# EAGLE design boardv1.1 (EAGLE 8.3.2)
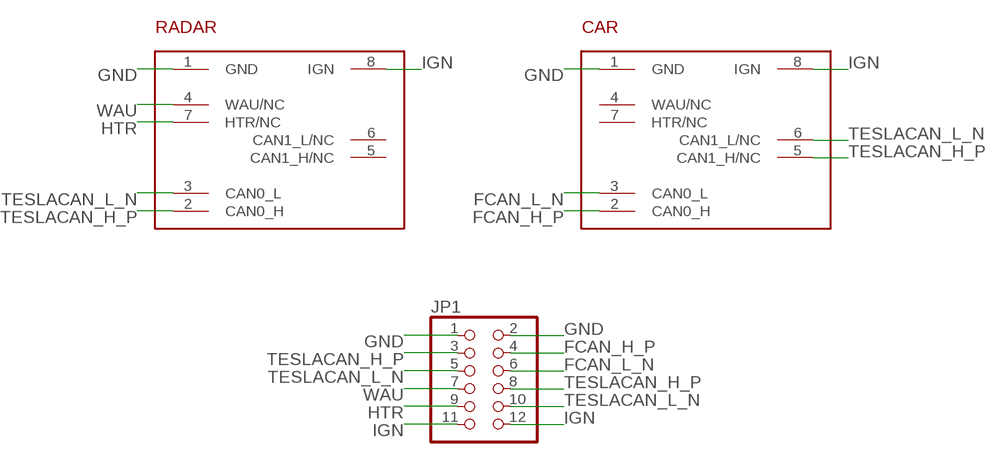
[diagram p0: schematic, sheet 1]

## Parts
CAR  TE_AMP_1-967658-1  [TE_AMP_1-967658-1]
JP1  PINHD-2X6/90  [2X06/90]
RADAR  TE_AMP_1-1534229-1TESLARADAR  [TE_AMP_1-1534229-1]

## Nets
FCAN_H_P [diff pairs]: CAR.2(CAN0_H) JP1.4
FCAN_L_N [diff pairs]: CAR.3(CAN0_L) JP1.6
GND [gnd]: CAR.1(GND) JP1.1 JP1.2 RADAR.1(GND)
HTR [hipower]: JP1.9 RADAR.7(HTR/NC)
IGN [hipower]: CAR.8(IGN) JP1.11 JP1.12 RADAR.8(IGN)
TESLACAN_H_P [diff pairs]: CAR.5(CAN1_H/NC) JP1.3 JP1.8 RADAR.2(CAN0_H)
TESLACAN_L_N [diff pairs]: CAR.6(CAN1_L/NC) JP1.5 JP1.10 RADAR.3(CAN0_L)
WAU: JP1.7 RADAR.4(WAU/NC)
Unconnected: CAR.4(WAU/NC) CAR.7(HTR/NC) RADAR.5(CAN1_H/NC) RADAR.6(CAN1_L/NC)

## Library data of the parts
CAR = Souers:TE_AMP_1-967658-1: Male portion. Mates with 1-1534229-1
JP1 = pinhead:PINHD-2X6: PIN HEADER
RADAR = Souers:TE_AMP_1-1534229-1: Used with bosch radar. Pairs with1-967658-1.

## Net classes
0 default: width 0.305 mm
1 diff pairs: width 0.305 mm, clearance 0.254 mm
2 hipower: width 0.889 mm
3 gnd: width 0.406 mm

## Board
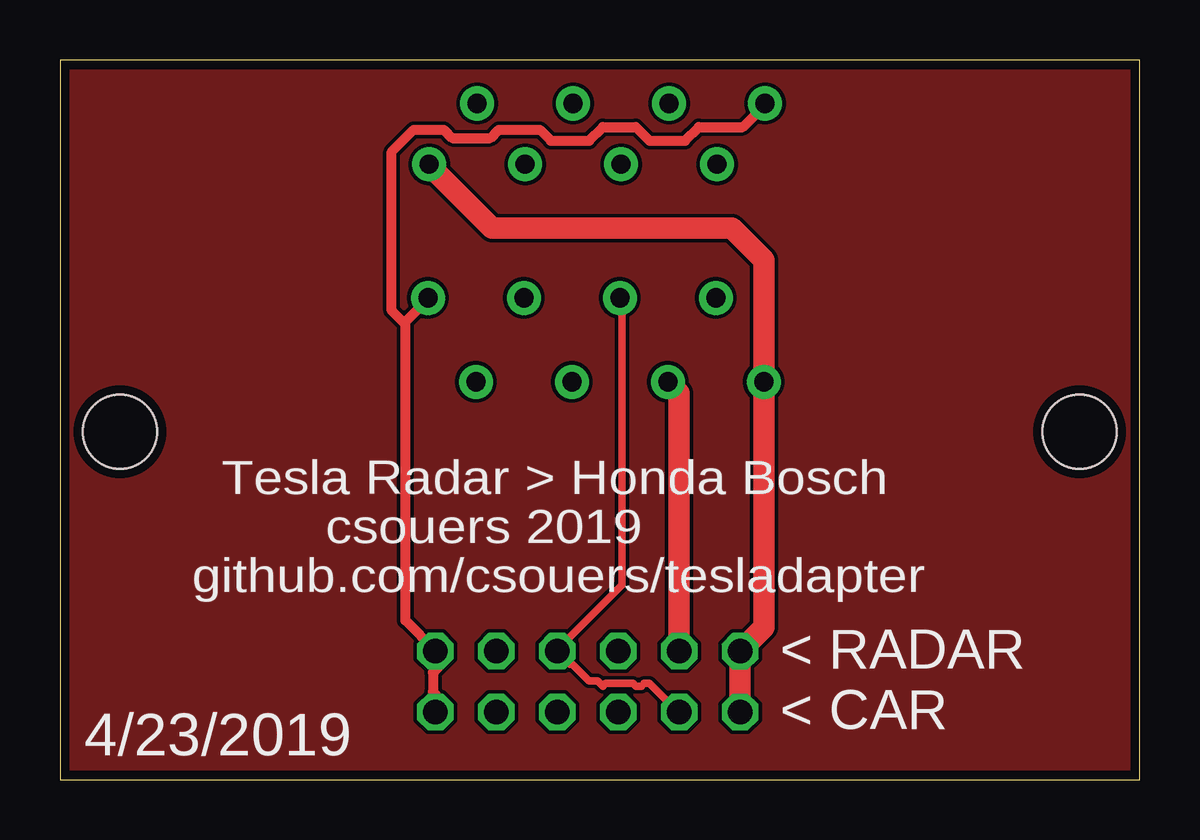
[diagram p1: board, top side]
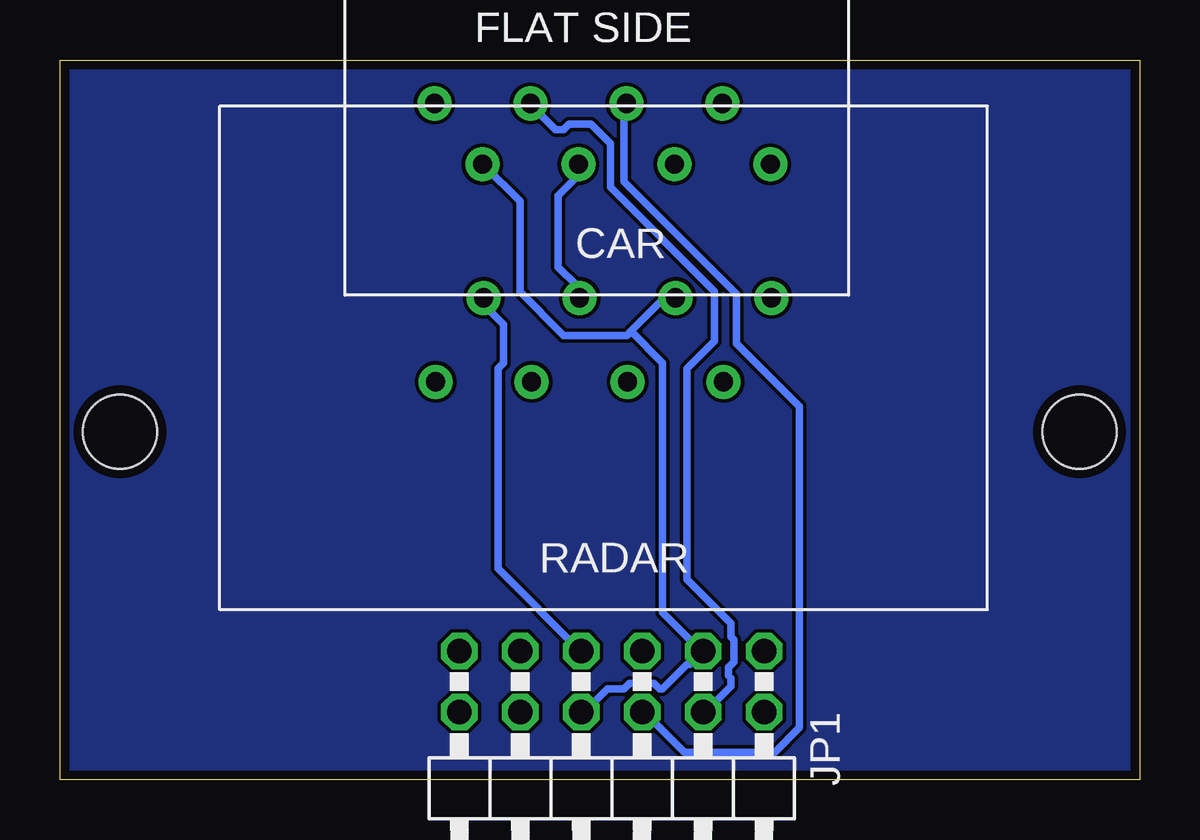
[diagram p2: board, bottom side, seen from below]

Size 45 x 30 mm. Coordinates in mm from the lower left corner, seen from the top.
Outline: 0,0 45,0 45,30 0,30 0,0
Copper layers (1*16): Top 0.035559375mm / dielectric 1.6mm / Bottom 0.035559375mm
Design rules "oshpark-2layer *": minimum track width 6mil, minimum drill 16mil, track to track 6mil, track to pad 6mil, pad to pad 6mil, via to via 6mil, smd to smd 6mil, copper to edge 15mil, drill to drill 6mil, minimum pad ring 5mil, minimum via ring 5mil, stop-mask expansion 2.5mil, vias tented up to drill 0mil, thermal gap 10mil
Holes 3.1 mm at 2.5,14.5 42.5,14.5

### Footprints (pad centres in the part's own frame; a part is rotated, then mirrored left to right if it is on the bottom)
TE_AMP_1-967658-1 = drill 0.8 pad 1.422: 1 12,0; 2 8,0; 3 4,0; 4 0,0; 5 10,2.54; 6 6,2.54; 7 2,2.54; 8 -2,2.54
2X06/90 = drill 1.016 octagon: 1 -6.35,-6.35; 2 -6.35,-3.81; 3 -3.81,-6.35; 4 -3.81,-3.81; 5 -1.27,-6.35; 6 -1.27,-3.81; 7 1.27,-6.35; 8 1.27,-3.81; 9 3.81,-6.35; 10 3.81,-3.81; 11 6.35,-6.35; 12 6.35,-3.81
TE_AMP_1-1534229-1 = drill 0.8 pad 1.422: 1 -8,0; 2 -4,0; 3 0,0; 4 4,0; 5 -6,3.5; 6 -2,3.5; 7 2,3.5; 8 6,3.5

### Placement (x,y rotation side)
CAR  17.39,28.19 180 bottom
JP1  22,-1 180 bottom
RADAR  23.34,20.08 180 bottom

### Tracks (layer width: path | path; a pad name or v marks a point on that pad's centre or on a via)
FCAN_H_P
  Bottom 0.305: CAR.2 25.38,28.12 24.35,27.09 24,27.09 23.77,27.32 22.86,27.32 22.06,26.52 22.06,24.69 17.72,20.34 17.72,18.29 18.86,17.14 18.86,8.34 17.03,6.51 17.03,5.94 16.92,5.83 16.92,4.92 17.14,4.69 17.14,4.34 17.03,4.23 17.03,3.89 18.17,2.74 JP1.4
FCAN_L_N
  Bottom 0.305: CAR.3 21.49,28.12 21.49,24.92 16.8,20.23 16.8,18.17 14.17,15.54 14.17,2.17 15.2,1.14 18.97,1.14 20.69,2.86 JP1.6
GND
  Top 0.406: 14.4,19.09 15.32,20 RADAR.1 | 14.4,19.09 14.4,6.63 15.66,5.37 JP1.1 15.77,5.26 15.77,4.69 15.54,4.46 15.54,3.66 15.66,3.54 15.66,2.86 JP1.2 | CAR.1 29.38,28.12 28.46,27.2 26.63,27.2 26.06,26.63 24.57,26.63 24,27.2 22.63,27.2 22.06,26.63 20.46,26.63 20,27.09 18.29,27.09 17.95,26.75 16.34,26.75 16,27.09 14.74,27.09 13.83,26.18 13.83,19.55 14.29,19.09 14.4,19.09
HTR
  Top 0.889: RADAR.7 25.81,16.11 JP1.9
IGN
  Top 0.889: CAR.8 15.39,25.61 18,23 28,23 29.34,21.66 RADAR.8 29.34,6.34 JP1.11 JP1.12
N$1
  pour Top: 45,0.1 45,30 0.1,30 0.1,0.1
  pour Bottom: 45,0.1 45,30 0.1,30 0.1,0.1
TESLACAN_H_P
  Bottom 0.305: JP1.8 23.2,2.74 22.17,3.77 21.49,3.77 21.26,4 20.23,4 20,3.77 19.89,3.77 18.86,4.8 18.75,4.8 18.29,5.26 JP1.3 18.29,5.37 19.89,6.97 19.89,17.37 21.2,18.69 | 21.2,18.69 21.37,18.52 24,18.52 25.83,20.34 25.83,24.12 27.32,25.6 CAR.5 | 21.2,18.69 19.89,20 19.43,20 RADAR.2
TESLACAN_L_N
  Top 0.305: JP1.10 25.72,2.86 24.57,4 24.35,4 24.23,3.89 24,3.89 23.89,4 22.75,4 22.63,3.89 22.4,4.12 22.06,4.12 21.37,4.8 21.26,4.8 20.8,5.26 JP1.5 20.8,5.49 23.43,8.12 23.43,20 RADAR.3
  Bottom 0.305: RADAR.3 23.43,20.12 23.43,20.57 24.23,21.37 24.23,24.35 23.43,25.15 23.43,25.6 CAR.6
WAU
  Bottom 0.305: RADAR.4 27.32,20 27.32,19.77 26.52,18.97 26.52,17.37 26.75,17.14 26.75,8.8 23.32,5.37 JP1.7

### Text on the board
tPlace: Tesla Radar > Honda Bosch / csouers 2019 / github.com/csouers/tesladapter | < RADAR / < CAR | 4/23/2019